# EAGLE design RGB Encoder Switcher v1p1 (EAGLE 9.6.2)
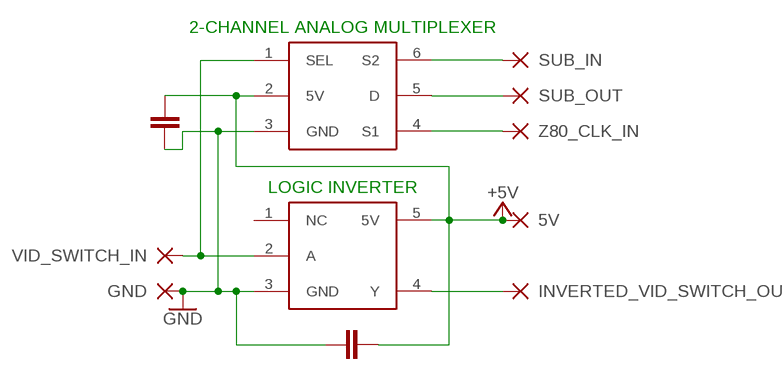
[diagram p0: schematic, sheet 1]

## Parts
5V  WIREPADCIRCLE-1,5X1,5  [CIRCLE-1,5X1,5]
C1  0.1uF  C-EUC0603  [C0603]
C2  0.1uF  C-EUC0603  [C0603]
GND  WIREPADCIRCLE-1,5X1,5  [CIRCLE-1,5X1,5]
INVERTED_VID_SWITCH_OUT  WIREPADCIRCLE-1,5X1,5  [CIRCLE-1,5X1,5]
INVERTER  74AHCT1G04DBVRE4  [SOT95P280X110-5N]
MULTIPLEXER  TMUX1219DBVR  [SOT95P280X110-6N]
SUB_IN  WIREPADCIRCLE-1,5X1,5  [CIRCLE-1,5X1,5]
SUB_OUT  WIREPADCIRCLE-1,5X1,5  [CIRCLE-1,5X1,5]
VID_SWITCH_IN  WIREPADCIRCLE-1,5X1,5  [CIRCLE-1,5X1,5]
Z80_CLK_IN  WIREPADCIRCLE-1,5X1,5  [CIRCLE-1,5X1,5]

## Nets
+5V: 5V.1(P) C1.1 C2.2 INVERTER.5(5V) MULTIPLEXER.2(5V)
GND: C1.2 C2.1 GND.1(P) INVERTER.3(GND) MULTIPLEXER.3(GND)
INVERTED_VID_SWITCH_OUT: INVERTED_VID_SWITCH_OUT.1(P) INVERTER.4(Y)
SUB_IN: MULTIPLEXER.6(S2) SUB_IN.1(P)
SUB_OUT: MULTIPLEXER.5(D) SUB_OUT.1(P)
VID_SWITCH_IN: INVERTER.2(A) MULTIPLEXER.1(SEL) VID_SWITCH_IN.1(P)
Z80_CLK_IN: MULTIPLEXER.4(S1) Z80_CLK_IN.1(P)
Unconnected: INVERTER.1(NC)

## Notes on the sheet
- 2-CHANNEL ANALOG MULTIPLEXER
- LOGIC INVERTER

## Library data of the parts
5V GND INVERTED_VID_SWITCH_OUT SUB_IN SUB_OUT VID_SWITCH_IN Z80_CLK_IN = Consoles Unleashed Eagle Parts Library:WIREPAD: Wire PAD connect wire on PCB
C1 C2 = Consoles Unleashed Eagle Parts Library:C-EU: CAPACITOR, European symbol; SPICEPREFIX: C
INVERTER = Consoles Unleashed Eagle Parts Library:74AHCT1G04DBVRE4
MULTIPLEXER = Consoles Unleashed Eagle Parts Library:TMUX1219DBVR

## Board
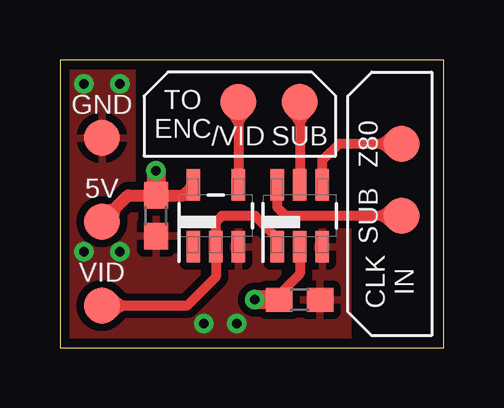
[diagram p1: board, top side]
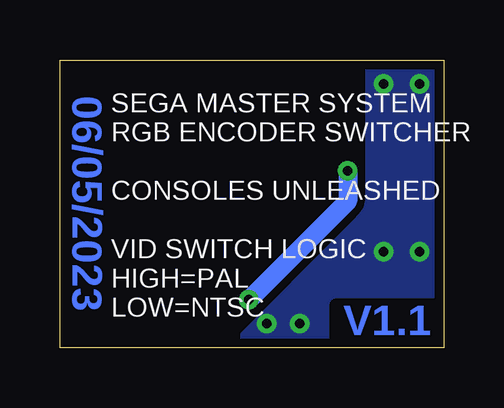
[diagram p2: board, bottom side, seen from below]

Size 16 x 12 mm. Coordinates in mm from the lower left corner, seen from the top.
Outline: 16,12 0,12 0,0 16,0 16,12
Copper layers (1*16): Top 0.035559375mm / dielectric 1.6mm / Bottom 0.035559375mm
Design rules "oshpark-2layer *": minimum track width 6mil, minimum drill 10mil, track to track 6mil, track to pad 6mil, pad to pad 6mil, via to via 6mil, smd to smd 6mil, copper to edge 15mil, drill to drill 6mil, minimum pad ring 5mil, minimum via ring 5mil, stop-mask expansion 2.5mil, vias tented up to drill 1mm, thermal gap 12mil

### Footprints (pad centres in the part's own frame; a part is rotated, then mirrored left to right if it is on the bottom)
CIRCLE-1,5X1,5 = smd 1.5 x 1.5: 1 0,0
C0603 = smd 1.1 x 1: 1 -0.85,0; 2 0.85,0
SOT95P280X110-5N = smd 1.321 x 0.559: 1 -1.295,0.94; 2 -1.295,0; 3 -1.295,-0.94; 4 1.295,-0.94; 5 1.295,0.94
SOT95P280X110-6N = smd 1.321 x 0.559: 1 -1.295,0.94; 2 -1.295,0; 3 -1.295,-0.94; 4 1.295,-0.94; 5 1.295,0; 6 1.295,0.94

### Placement (x,y rotation side)
5V  1.75,5.25 0 top
C1  10,2 0 top
C2  4,5.5 90 top
GND  1.75,8.75 0 top
INVERTED_VID_SWITCH_OUT  7.44,10.25 0 top
INVERTER  6.5,5.5 90 top
MULTIPLEXER  10,5.5 90 top
SUB_IN  14.25,5.5 0 top
SUB_OUT  10,10.25 0 top
VID_SWITCH_IN  1.75,1.75 0 top
Z80_CLK_IN  14.25,8.5 0 top

### Tracks (layer width: path | path; a pad name or v marks a point on that pad's centre or on a via)
+5V  (via drill 0.4 pad 0.8)
  Top 0.305: 2.43,5.93 arc20 2.31,5.34 1.84,5.82 arc20 2.43,5.93
  Top 0.406: MULTIPLEXER.2 10,3.08 9.15,2.23 C1.1
  Top 0.508: 5V.1 2.85,6.35 C2.2 5.15,6.35 5.56,6.76 INVERTER.5
  Top 0.8: v4,7.38 C2.2 | C1.1 v8.12,2
  Bottom 0.8: v8.12,2 4,6.12 v4,7.38
GND  (via drill 0.4 pad 0.8)
  other vias: 1,4 2.5,4 7.38,1 6,1 1,11 2.5,11
  pour Top (isolate 0.305): 0,12 3,12 3,5.5 12,5.5 12,0 0,0
  pour Bottom (isolate 0.305): 0,0 0,12 3.12,12 3.12,6.45 arc45 3.62,5.26 8.88,0
INVERTED_VID_SWITCH_OUT
  Top 0.305: 7.44,9.26 arc20 7.11,9.75 7.77,9.75 arc20 7.44,9.26
  Top 0.406: 7.44,10.19 INVERTER.4
  Top 0.508: INVERTED_VID_SWITCH_OUT.1 7.44,10.19
SUB_IN
  Top 0.305: 13.25,5.5 arc20 13.75,5.83 13.75,5.17 arc20 13.25,5.5
  Top 0.406: SUB_IN.1 9.44,5.5 9.06,5.88 MULTIPLEXER.6
SUB_OUT
  Top 0.305: 10,9.25 arc20 9.67,9.75 10.33,9.75 arc20 10,9.25
  Top 0.406: SUB_OUT.1 MULTIPLEXER.5
VID_SWITCH_IN
  Top 0.305: 2.75,1.75 arc20 2.25,1.42 2.25,2.08 arc20 2.75,1.75
  Top 0.406: VID_SWITCH_IN.1 5.29,1.75 6.5,2.96 INVERTER.2 6.5,5.25 6.75,5.5 8.14,5.5 9.06,4.58 MULTIPLEXER.1
Z80_CLK_IN
  Top 0.305: 13.25,8.5 arc20 13.75,8.83 13.75,8.17 arc20 13.25,8.5
  Top 0.406: Z80_CLK_IN.1 11.62,8.5 10.94,7.82 MULTIPLEXER.4

### Text on the board
Bottom: 06/05/2023 | V1.1
tNames: TO / ENC | /VID | SUB | Z80 | SUB | VID | CLK / IN
bNames: SEGA MASTER SYSTEM / RGB ENCODER SWITCHER / / CONSOLES UNLEASHED / / VID SWITCH LOGIC / HIGH=PAL / LOW=NTSC